# Altium schematic sheet [08]CAN.SchDoc
size B
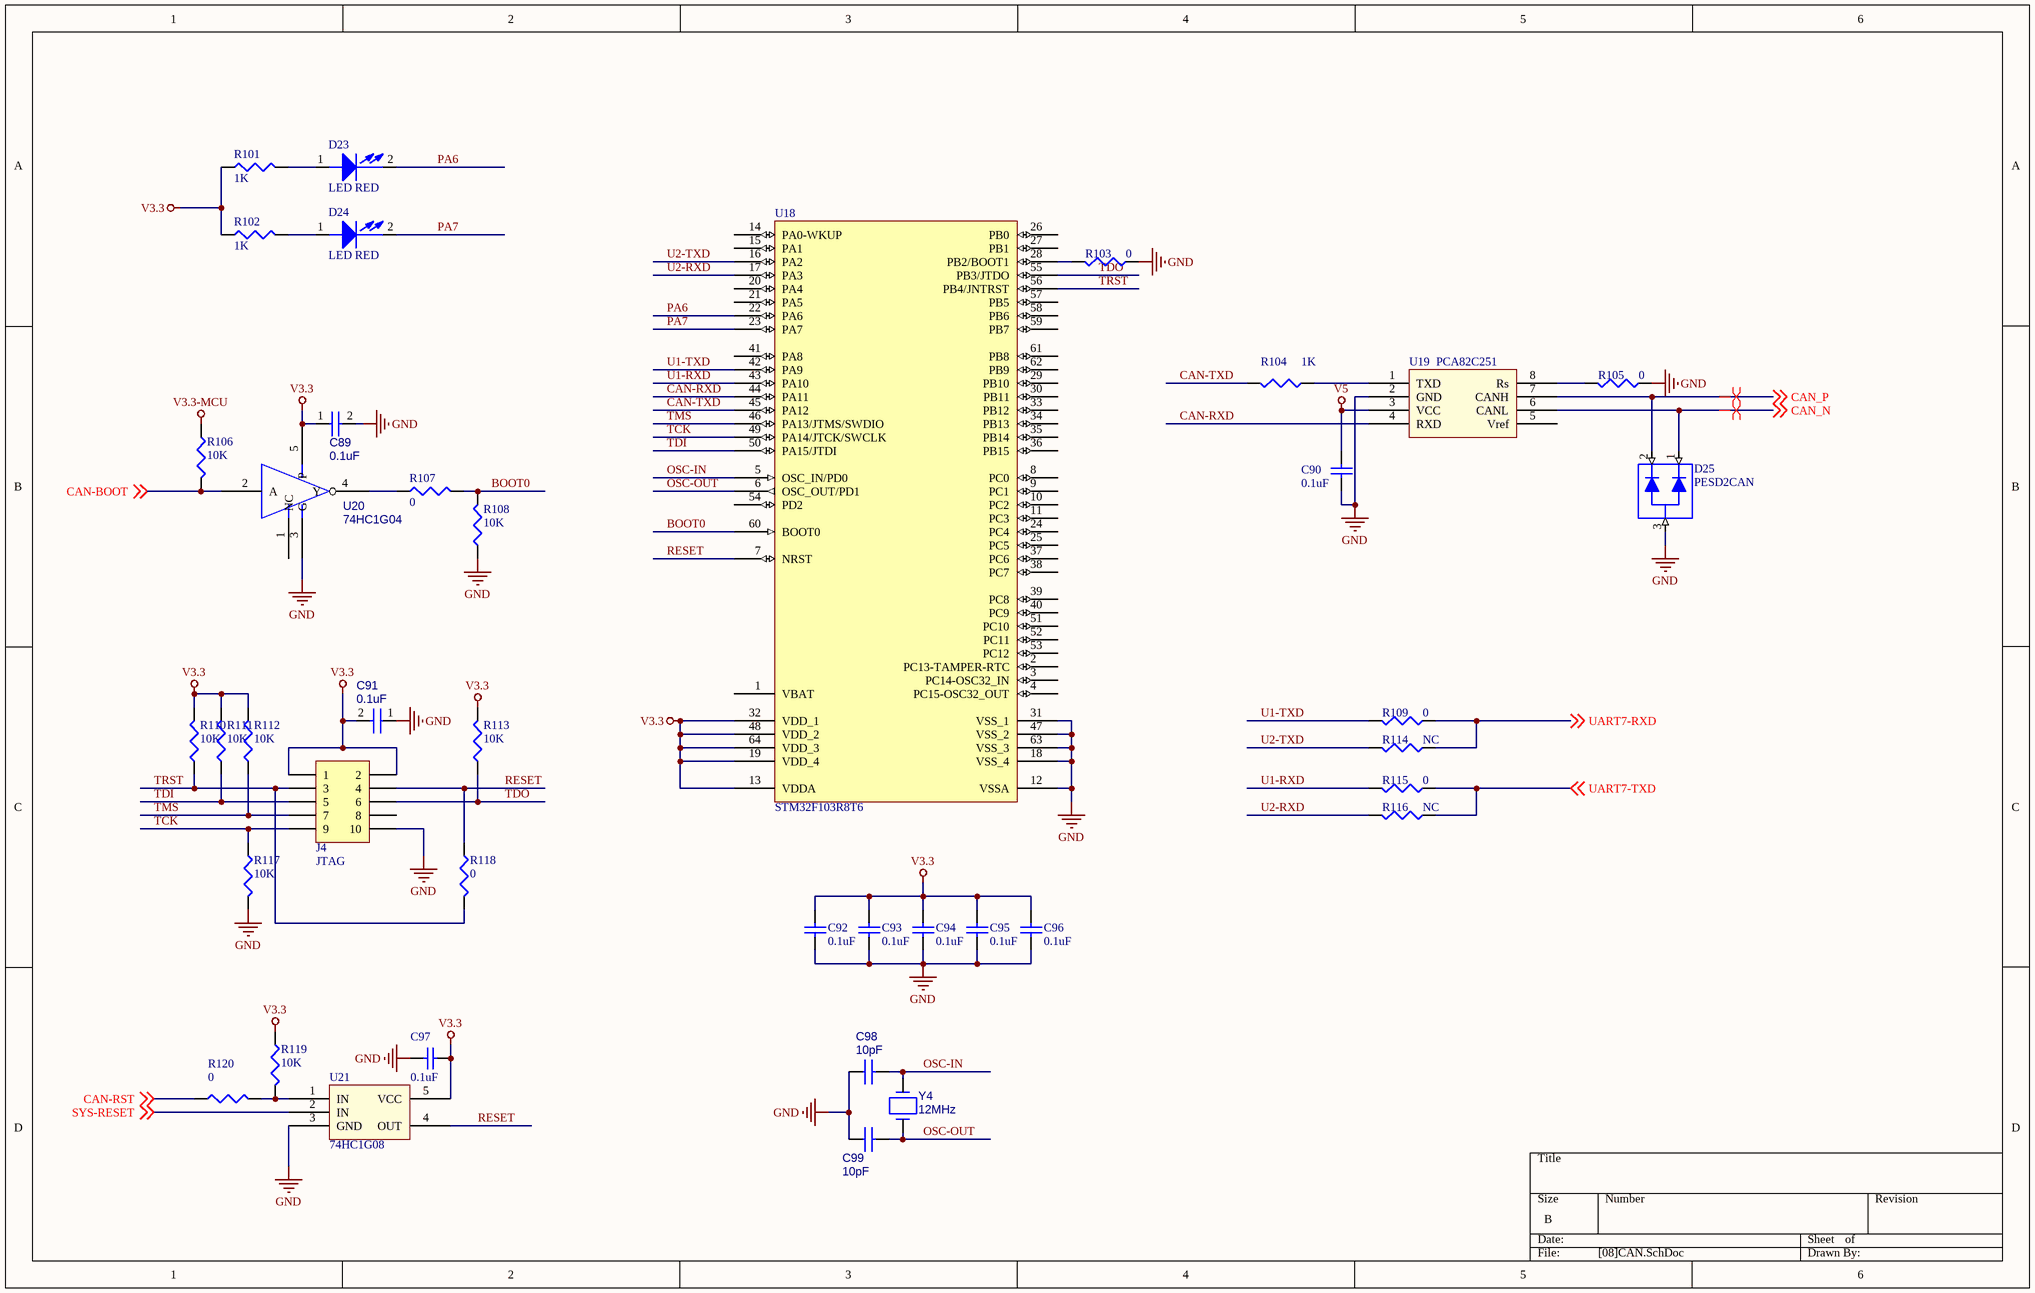
[diagram p0: [08]CAN.SchDoc]

## Parts
C89  0.1uF  [0603]
C90  0.1uF  [0603]
C91  0.1uF  [0603]
C92  0.1uF  [0603]
C93  0.1uF  [0603]
C94  0.1uF  [0603]
C95  0.1uF  [0603]
C96  0.1uF  [0603]
C97  0.1uF  [0603]
C98  10pF  [0603]
C99  10pF  [0603]
D23  LED RED  [LED0603]
D24  LED RED  [LED0603]
D25  PESD2CAN  [PESD2CAN]
J4  JTAG  [HDR2X5]
R101  1K  [0603]
R102  1K  [0603]
R103  0  [0603]
R104  1K  [0603]
R105  0  [0603]
R106  10K  [0603]
R107  0  [0603]
R108  10K  [0603]
R109  0  [0603]
R110  10K  [0603]
R111  10K  [0603]
R112  10K  [0603]
R113  10K  [0603]
R114  NC  [0603]
R115  0  [0603]
R116  NC  [0603]
R117  10K  [0603]
R118  0  [0603]
R119  10K  [0603]
R120  0  [0603]
U18  STM32F103R8T6  [LQFP64_N]
U19  PCA82C251  [SO8]
U20  74HC1G04  [SOT753]
U21  74HC1G08  [SOT23-5]
Y4  12MHz  [XTAL_SMD]

## Nets
GND: C89.2 C90.1 C91.1 C92.1 C93.1 C94.1 C95.1 C96.1 C97.2 C98.1 C99.1 D25.3 J4.10 R103.1 R105.1 R108.1 R117.2 U18.12(VSSA) U18.18(VSS_4) U18.31(VSS_1) U18.47(VSS_2) U18.63(VSS_3) U19.2(GND) U20.3(G) U21.3(GND)
V3.3: C89.1 C91.2 C92.2 C93.2 C94.2 C95.2 C96.2 C97.1 J4.1 J4.2 R101.1 R102.1 R110.2 R111.2 R112.2 R113.2 R119.1 U18.13(VDDA) U18.19(VDD_4) U18.32(VDD_1) U18.48(VDD_2) U18.64(VDD_3) U20.5(P) U21.5(VCC)
V3.3-MCU: R106.1
V5: C90.2 U19.3(VCC)
BOOT0: R107.2 R108.2 U18.60(BOOT0)
CAN-BOOT: R106.2 U20.2(A) ; off-sheet CAN-BOOT
CAN-RST: R120.1 ; off-sheet CAN-RST
CAN-RXD: U18.44(PA11) U19.4(RXD)
CAN-TXD: R104.2 U18.45(PA12)
CAN_N: D25.1 U19.6(CANL) ; off-sheet CAN_N
CAN_P: D25.2 U19.7(CANH) ; off-sheet CAN_P
OSC-IN: C98.2 U18.5(OSC_IN/PD0) Y4.2
OSC-OUT: C99.2 U18.6(OSC_OUT/PD1) Y4.1
PA6: D23.2(CATHODE) U18.22(PA6)
PA7: D24.2(CATHODE) U18.23(PA7)
RESET: J4.4 R118.1 U18.7(NRST) U21.4(OUT)
SYS-RESET: U21.2(IN) ; off-sheet SYS-RESET
TCK: J4.9 R117.1 U18.49(PA14/JTCK/SWCLK)
TDI: J4.5 R111.1 U18.50(PA15/JTDI)
TDO: J4.6 R113.1 U18.55(PB3/JTDO)
TMS: J4.7 R112.1 U18.46(PA13/JTMS/SWDIO)
TRST: J4.3 R110.1 R118.2 U18.56(PB4/JNTRST)
U1-RXD: R115.2 U18.43(PA10)
U1-TXD: R109.2 U18.42(PA9)
U2-RXD: R116.2 U18.17(PA3)
U2-TXD: R114.2 U18.16(PA2)
UART7-RXD: R109.1 R114.1 ; off-sheet UART7-RXD
UART7-TXD: R115.1 R116.1 ; off-sheet UART7-TXD
NetD23_1: D23.1(ANODE) R101.2
NetD24_1: D24.1(ANODE) R102.2
NetR103_2: R103.2 U18.28(PB2/BOOT1)
NetR104_1: R104.1 U19.1(TXD)
NetR105_2: R105.2 U19.8(Rs)
NetR107_1: R107.1 U20.4(Y)
NetR119_2: R119.2 R120.2 U21.1(IN)

Not connected (* = marked no-connect by the designer): J4 8; U18 1(VBAT) 2(PC13-TAMPER-RTC) 3(PC14-OSC32_IN) 4(PC15-OSC32_OUT) 8(PC0) 9(PC1) 10(PC2) 11(PC3) 14(PA0-WKUP) 15(PA1) 20(PA4) 21(PA5) 24(PC4) 25(PC5) 26(PB0) 27(PB1) 29(PB10) 30(PB11) 33(PB12) 34(PB13) 35(PB14) 36(PB15) 37(PC6) 38(PC7) 39(PC8) 40(PC9) 41(PA8) 51(PC10) 52(PC11) 53(PC12) 54(PD2) 57(PB5) 58(PB6) 59(PB7) 61(PB8) 62(PB9); U19 5(Vref); U20 1(NC)

## Layout directives
differential pair: CAN_N, CAN_P

## Library data of the parts
C89 C91 = CAP NP_Dup2
C90 C92-C97 = Cap: Capacitor
C98 C99 = CAP_Dup1
D23 D24 = LN01401_1
D25 = PESD2CAN: Part Number: SCA00000J00
J4 = Header 5X2: Header, 5-Pin, Dual row
R101 R102 R106 = CR16-1003FM
R103-R105 R107-R120 = Res3: Resistor
U18 = STM32F103R8T6: STM32 ARM-based 32-bit MCU with 64 Kbytes Flash, 64-pin LQFP, Industrial Temperature; Published: 30-May-2008; DatasheetVersion: rev6, Mar-2008; PackageVersion: Mar-2008; PackageReference: LQFP64; Publisher: Altium Limited; PackageDescription: 64-Pin Low-Profile Quad Flat Pack, 10 x 10 mm Body, 0.5 mm Pitch (LQFP64); ComponentLink1Description: Manufacturer Link; ComponentLink1URL: www.st.com/stm32; ComponentLink2Description: Datasheet; ComponentLink2URL: http://www.st.com/stonline/products/literature/ds/13587.pdf
U20 = 74LVC1G04GW_SOT353-5: Part  Number: SA00000FX00
Y4 = CRYSTAL